# Altium project CAN_CANS6.PrjPcb
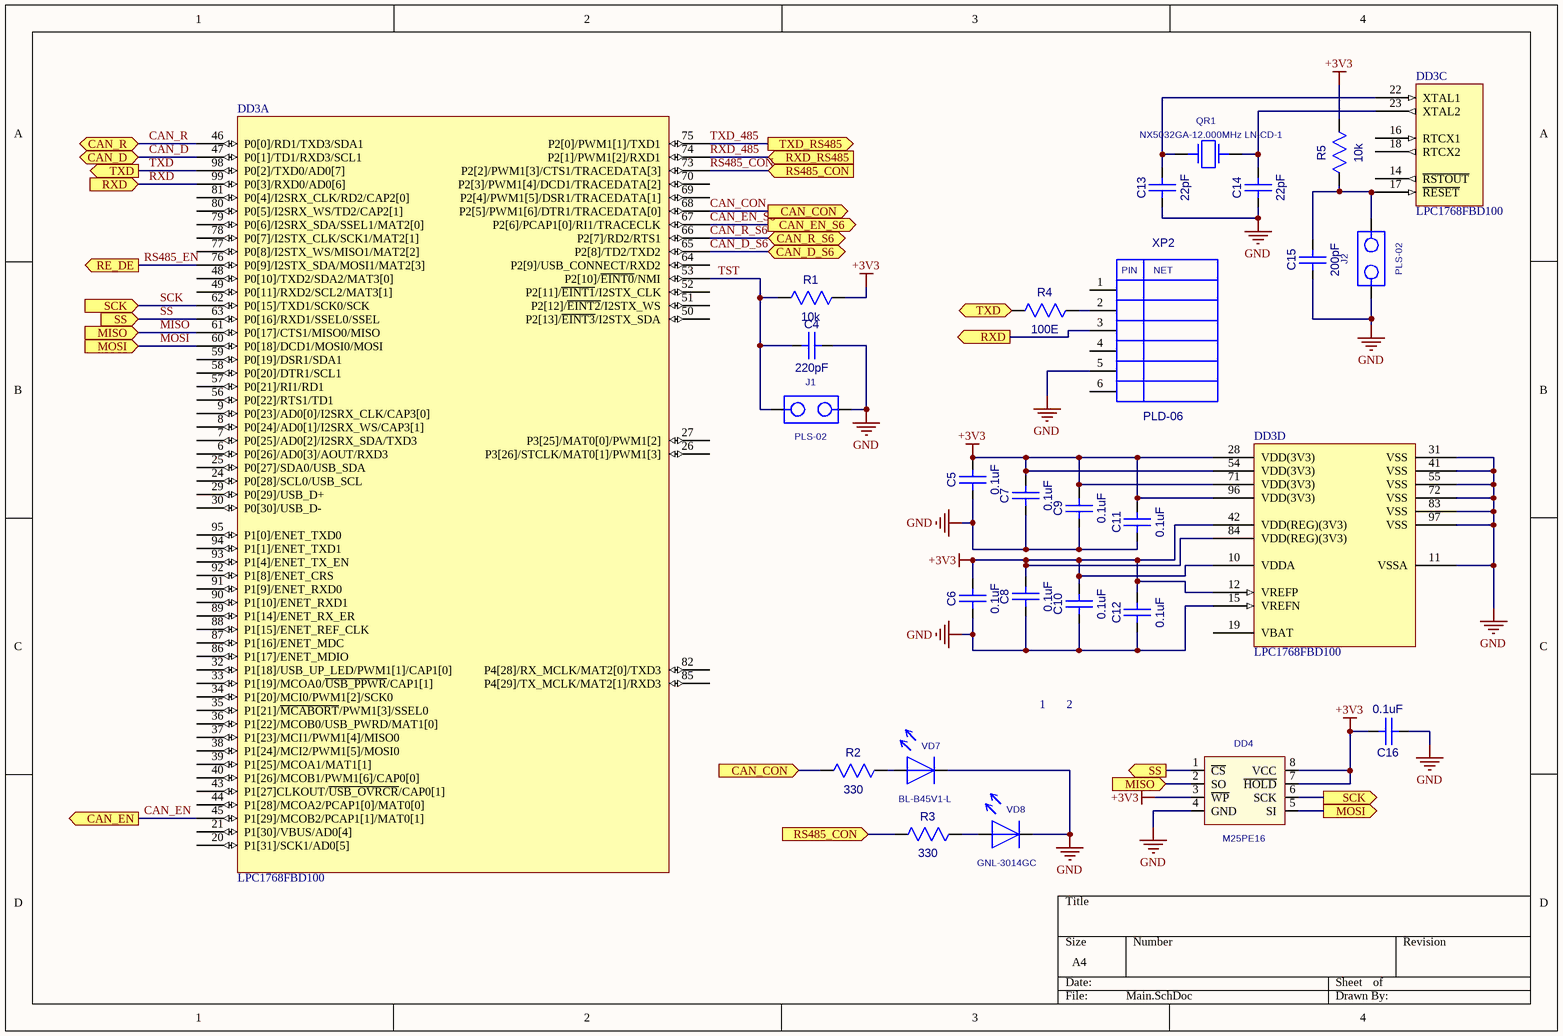
[diagram p0: Main.SchDoc]
3 sheets, 72 parts. Net scope: flat (ports and power ports of the same name join across sheets).
Board file: CAN_CANS6.PcbDoc
Sheets:
  Main.SchDoc
  Interface.SchDoc
  Power.SchDoc

## Sheet Main.SchDoc
size A4

### Parts
1  REPER1.2  [REPER1.2]  (value not drawn)
2  REPER1.2  [REPER1.2]  (value not drawn)
C4  220pF  [CC0603-3M]
C5  0.1uF  [CC0603-3M]
C6  0.1uF  [CC0603-3M]
C7  0.1uF  [CC0603-3M]
C8  0.1uF  [CC0603-3M]
C9  0.1uF  [CC0603-3M]
C10  0.1uF  [CC0603-3M]
C11  0.1uF  [CC0603-3M]
C12  0.1uF  [CC0603-3M]
C13  22pF  [CC0603-3M]
C14  22pF  [CC0603-3M]
C15  200pF  [CC0603-3M]
C16  0.1uF  [CC0603-3M]
DD3  LPC1768FBD100  [TQFP-100]  (parts A,C,D of 4)
DD4  M25PE16  [EIAJ_SO8]
J1  PLS-02  [PLS-02]
J2  PLS-02  [PIN2W]
QR1  NX5032GA-12.000MHz LN-CD-1  [AC5032_2]
R1  10k  [RC0603-3M]
R2  330  [RC0603-3M]
R3  330  [RC0603-3M]
R4  100E  [RC0603-3M]
R5  10k  [RC0603-3M]
VD7  BL-B45V1-L  [LED3]
VD8  GNL-3014GC  [LED3]
XP2  PLD-06  [PLD-06]

### Ports
CAN_CON (in), CAN_CON (out), CAN_D, CAN_D_S6, CAN_EN (out), CAN_EN_S6 (out), CAN_R, CAN_R_S6, MISO (in), MOSI (in), MOSI (out), RE_DE (out), RS485_CON (in), RXD (in), RXD (out), RXD_RS485 (in), SCK (in), SCK (out), SS (in), SS (out), TXD (in), TXD (out), TXD_RS485 (out)

### Nets
+3V3: C5.2(B) C6.2(B) C7.2(B) C8.2(B) C9.2(B) C10.2(B) C11.2(B) C12.2(B) C16.2(B) DD3.10(VDDA) DD3.12(VREFP) DD3.28(VDD(3V3)) DD3.42(VDD(REG)(3V3)) DD3.54(VDD(3V3)) DD3.71(VDD(3V3)) DD3.84(VDD(REG)(3V3)) DD3.96(VDD(3V3)) DD4.3(~{WP}) DD4.7(~{HOLD}) DD4.8(VCC) R1.2(B) R5.2(B)
GND: C4.2(B) C5.1(A) C6.1(A) C7.1(A) C8.1(A) C9.1(A) C10.1(A) C11.1(A) C12.1(A) C13.1(A) C14.1(A) C15.1(A) C16.1(A) DD3.11(VSSA) DD3.15(VREFN) DD3.31(VSS) DD3.41(VSS) DD3.55(VSS) DD3.72(VSS) DD3.83(VSS) DD3.97(VSS) DD4.4(GND) J1.2 J2.1 VD7.1 VD8.1 XP2.5
CAN_CON: DD3.68(P2[5]/PWM1[6]/DTR1/TRACEDATA[0]) R2.1(A) ; port CAN_CON
CAN_D: DD3.47(P0[1]/TD1/RXD3/SCL1) ; port CAN_D
CAN_D_S6: DD3.65(P2[8]/TD2/TXD2) ; port CAN_D_S6
CAN_EN: DD3.45(P1[29]/MCOB2/PCAP1[1]/MAT0[1]) ; port CAN_EN
CAN_EN_S6: DD3.67(P2[6]/PCAP1[0]/RI1/TRACECLK) ; port CAN_EN_S6
CAN_R: DD3.46(P0[0]/RD1/TXD3/SDA1) ; port CAN_R
CAN_R_S6: DD3.66(P2[7]/RD2/RTS1) ; port CAN_R_S6
MISO: DD3.61(P0[17]/CTS1/MISO0/MISO) DD4.2(SO) ; port MISO
MOSI: DD3.60(P0[18]/DCD1/MOSI0/MOSI) DD4.5(SI) ; port MOSI
RS485_CON: DD3.73(P2[2]/PWM1[3]/CTS1/TRACEDATA[3]) R3.1(A) ; port RS485_CON
RS485_EN: DD3.76(P0[9]/I2STX_SDA/MOSI1/MAT2[3]) ; port RE_DE
RXD: DD3.99(P0[3]/RXD0/AD0[6]) XP2.3 ; port RXD
RXD_485: DD3.74(P2[1]/PWM1[2]/RXD1) ; port RXD_RS485
SCK: DD3.62(P0[15]/TXD1/SCK0/SCK) DD4.6(SCK) ; port SCK
SS: DD3.63(P0[16]/RXD1/SSEL0/SSEL) DD4.1(~{CS}) ; port SS
TST: C4.1(A) DD3.53(P2[10]/~{EINT0}/NMI) J1.1 R1.1(A)
TXD: DD3.98(P0[2]/TXD0/AD0[7]) R4.1(A) ; port TXD
TXD_485: DD3.75(P2[0]/PWM1[1]/TXD1) ; port TXD_RS485
NetC13_2: C13.2(B) DD3.22(XTAL1) QR1.1
NetC14_2: C14.2(B) DD3.23(XTAL2) QR1.2
NetC15_2: C15.2(B) DD3.17(~{RESET}) J2.2 R5.1(A)
NetR2_2: R2.2(B) VD7.2
NetR3_2: R3.2(B) VD8.2
NetR4_2: R4.2(B) XP2.2

Not connected (* = marked no-connect by the designer): 1 1; 2 1; DD3 6(P0[26]/AD0[3]/AOUT/RXD3) 7(P0[25]/AD0[2]/I2SRX_SDA/TXD3) 8(P0[24]/AD0[1]/I2SRX_WS/CAP3[1]) 9(P0[23]/AD0[0]/I2SRX_CLK/CAP3[0]) 14(~{RSTOUT}) 16(RTCX1) 18(RTCX2) 19(VBAT) 20(P1[31]/SCK1/AD0[5]) 21(P1[30]/VBUS/AD0[4]) 24(P0[28]/SCL0/USB_SCL) 25(P0[27]/SDA0/USB_SDA) 26(P3[26]/STCLK/MAT0[1]/PWM1[3]) 27(P3[25]/MAT0[0]/PWM1[2]) 29(P0[29]/USB_D+) 30(P0[30]/USB_D-) 32(P1[18]/USB_UP_LED/PWM1[1]/CAP1[0]) 33(P1[19]/MCOA0/~{USB_PPWR}/CAP1[1]) 34(P1[20]/MCI0/PWM1[2]/SCK0) 35(P1[21]/~{MCABORT}/PWM1[3]/SSEL0) 36(P1[22]/MCOB0/USB_PWRD/MAT1[0]) 37(P1[23]/MCI1/PWM1[4]/MISO0) 38(P1[24]/MCI2/PWM1[5]/MOSI0) 39(P1[25]/MCOA1/MAT1[1]) 40(P1[26]/MCOB1/PWM1[6]/CAP0[0]) 43(P1[27]CLKOUT/~{USB_OVRCR}/CAP0[1]) 44(P1[28]/MCOA2/PCAP1[0]/MAT0[0]) 48(P0[10]/TXD2/SDA2/MAT3[0]) 49(P0[11]/RXD2/SCL2/MAT3[1]) 50(P2[13]/~{EINT3}/I2STX_SDA) 51(P2[12]/~{EINT2}/I2STX_WS) 52(P2[11]/~{EINT1}/I2STX_CLK) 56(P0[22]/RTS1/TD1) 57(P0[21]/RI1/RD1) 58(P0[20]/DTR1/SCL1) 59(P0[19]/DSR1/SDA1) 64(P2[9]/USB_CONNECT/RXD2) 69(P2[4]/PWM1[5]/DSR1/TRACEDATA[1]) 70(P2[3]/PWM1[4]/DCD1/TRACEDATA[2]) 77(P0[8]/I2STX_WS/MISO1/MAT2[2]) 78(P0[7]/I2STX_CLK/SCK1/MAT2[1]) 79(P0[6]/I2SRX_SDA/SSEL1/MAT2[0]) 80(P0[5]/I2SRX_WS/TD2/CAP2[1]) 81(P0[4]/I2SRX_CLK/RD2/CAP2[0]) 82(P4[28]/RX_MCLK/MAT2[0]/TXD3) 85(P4[29]/TX_MCLK/MAT2[1]/RXD3) 86(P1[17]/ENET_MDIO) 87(P1[16]/ENET_MDC) 88(P1[15]/ENET_REF_CLK) 89(P1[14]/ENET_RX_ER) 90(P1[10]/ENET_RXD1) 91(P1[9]/ENET_RXD0) 92(P1[8]/ENET_CRS) 93(P1[4]/ENET_TX_EN) 94(P1[1]/ENET_TXD1) 95(P1[0]/ENET_TXD0); XP2 1 4 6

### Notes on the sheet
- (in symbol PLD-06) PIN; NET

### Library data of the parts
C4-C16 = CC0603
  C4: Value: 220pF
  C5-C12 C16: Value: 0.1uF
  C13 C14: Value: 22pF
  C15: Value: 200pF
DD3 = LPC1768FBD100: Cortex -M3 32-Bit Microcontroller, 512KB Flash, 64KB RAM, 100-Lead LQFP; ComponentLink1Description: Manufacturer Link; ComponentLink1URL: http://www.nxp.com/
DD4 = S25FL016A0LMFI01: Value: M25PE16
QR1 = AC5032_2: AC5032/2; Value: NX5032GA-12.000MHz LN-CD-1
R1-R5 = RC0603
  R1 R5: Value: 10k
  R2 R3: Value: 330
  R4: Value: 100E
VD7 VD8 = LED_3
  VD7: Value: BL-B45V1-L
  VD8: Value: GNL-3014GC
XP2 = PLD-06: PLD06; Value: *
1 2 = REPER1.2: Value: *
J1 J2 = PLS-02: Value: *

## Sheet Interface.SchDoc
size A4
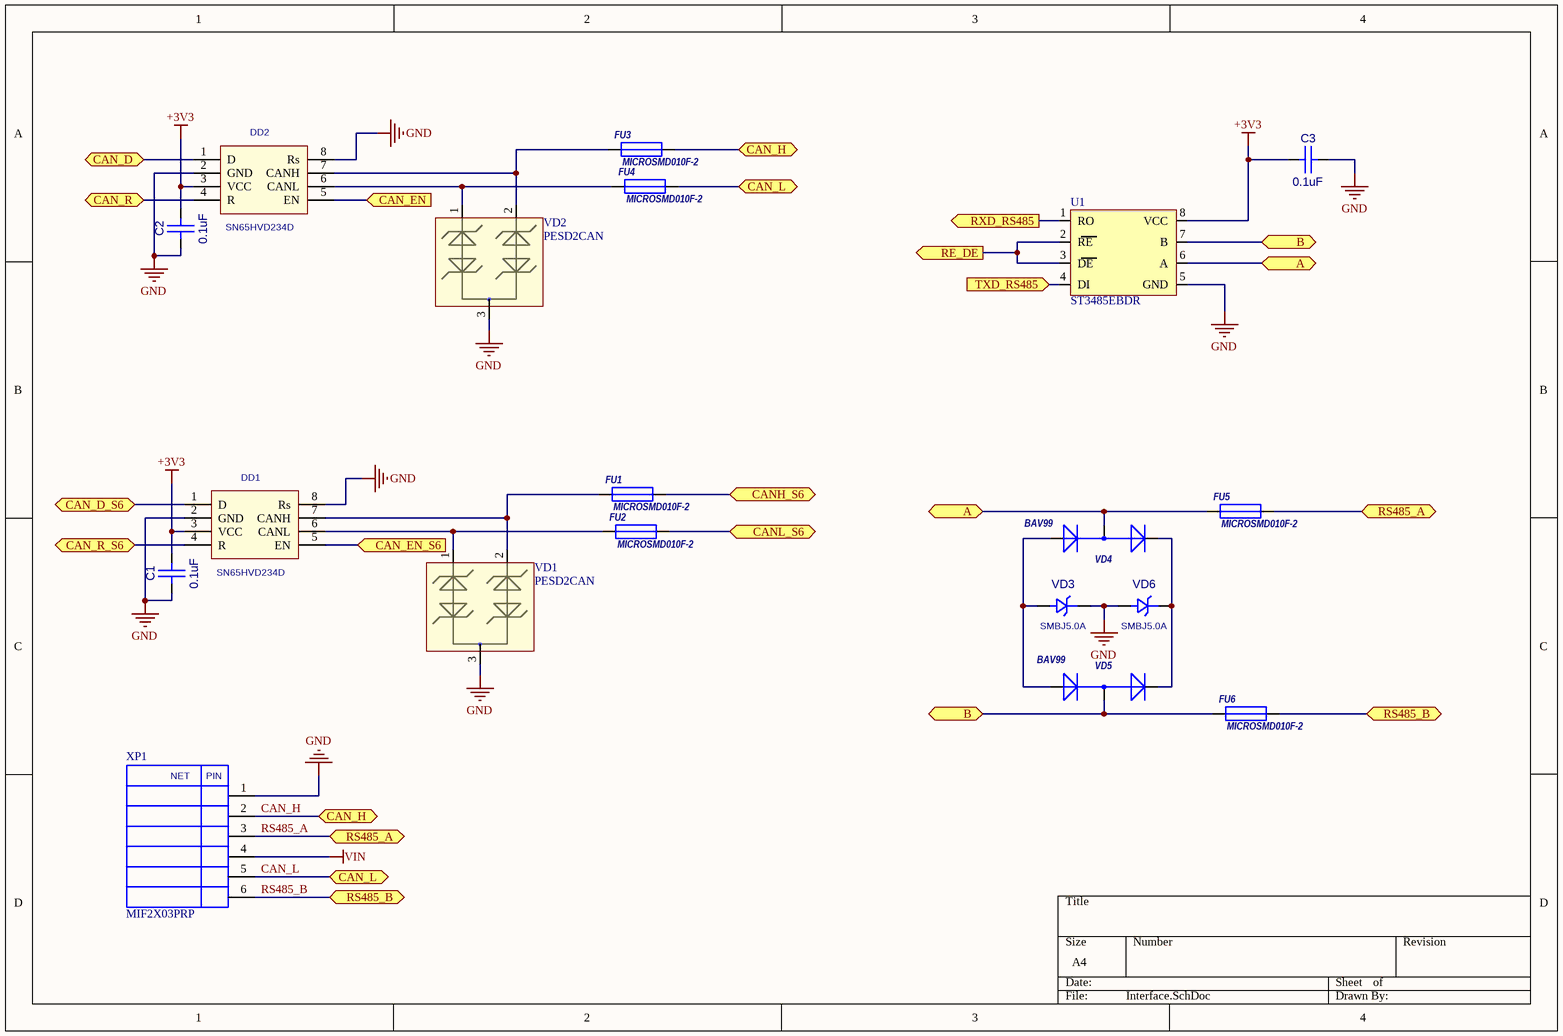
[diagram p1: Interface.SchDoc]

### Parts
C1  0.1uF  [CC0603-3M]
C2  0.1uF  [CC0603-3M]
C3  0.1uF  [CC0603-3M]
DD1  SN65HVD234D  [SO-8]
DD2  SN65HVD234D  [SO-8]
FU1  MICROSMD010F-2  [RC1210]
FU2  MICROSMD010F-2  [RC1210]
FU3  MICROSMD010F-2  [RC1210]
FU4  MICROSMD010F-2  [RC1210]
FU5  MICROSMD010F-2  [RC1210]
FU6  MICROSMD010F-2  [RC1210]
U1  ST3485EBDR  [SO-8]
VD1  PESD2CAN  [SOT-23(123)]
VD2  PESD2CAN  [SOT-23(123)]
VD3  SMBJ5.0A  [SMB]
VD4  BAV99  [SOT-23(GSD)]
VD5  BAV99  [SOT-23(GSD)]
VD6  SMBJ5.0A  [SMB]
XP1  MIF2X03PRP  [MIF2X03PRP]

### Ports
A (bidir), B (bidir), CAN_D, CAN_D_S6, CAN_EN (in), CAN_EN_S6 (in), CAN_H, CAN_L, CAN_R, CAN_R_S6, CANH_S6, CANL_S6, RE_DE (out), RS485_A, RS485_B, RXD_RS485 (out), TXD_RS485 (in)

### Nets
+3V3: C1.2(B) C2.2(B) C3.1(A) DD1.3(VCC) DD2.3(VCC) U1.8(VCC)
GND: C1.1(A) C2.1(A) C3.2(B) DD1.2(GND) DD1.8(Rs) DD2.2(GND) DD2.8(Rs) U1.5(GND) VD1.3 VD2.3 VD3.2(K) VD6.1(A) XP1.1
VIN: XP1.4
CAN_D: DD2.1(D) ; port CAN_D
CAN_D_S6: DD1.1(D) ; port CAN_D_S6
CAN_EN: DD2.5(EN) ; port CAN_EN
CAN_EN_S6: DD1.5(EN) ; port CAN_EN_S6
CAN_H: FU3.2 XP1.2 ; port CAN_H
CAN_L: FU4.2 XP1.5 ; port CAN_L
CAN_R: DD2.4(R) ; port CAN_R
CAN_R_S6: DD1.4(R) ; port CAN_R_S6
CANH_S6: FU1.2 ; port CANH_S6
CANL_S6: FU2.2 ; port CANL_S6
RS485_A: FU5.2 XP1.3 ; port RS485_A
RS485_B: FU6.2 XP1.6 ; port RS485_B
RS485_EN: U1.2(RE) U1.3(DE) ; port RE_DE
RXD_485: U1.1(RO) ; port RXD_RS485
TXD_485: U1.4(DI) ; port TXD_RS485
NetDD1_6: DD1.6(CANL) FU2.1 VD1.1
NetDD1_7: DD1.7(CANH) FU1.1 VD1.2
NetDD2_6: DD2.6(CANL) FU4.1 VD2.1
NetDD2_7: DD2.7(CANH) FU3.1 VD2.2
NetFU5_1: FU5.1 U1.6(A) VD4.3(AK) ; port A
NetFU6_1: FU6.1 U1.7(B) VD5.3(AK) ; port B
NetVD3_1: VD3.1(A) VD4.1(A) VD5.1(A)
NetVD4_2: VD4.2(K) VD5.2(K) VD6.2(K)

### Library data of the parts
C1-C3 = CC0603: Value: 0.1uF
DD1 DD2 = SN65HVD234D: CAN Transceiver; Value: *
FU1-FU6 = MICROSMD
  FU1-FU4: Value: MICROSMD010F-2
  FU5 FU6: Value: *
VD1 VD2 = PESD2CAN: TVS for CAN
VD3 VD6 = SMBJ: Value: SMBJ5.0A
VD4 VD5 = BAV99: 1.0 Ampere General Purpose Rectifier; ComponentField6: Published 8-Jun-2000, Modified 11-July-2000: SIM Model Added.; Value: *
U1 = ST3485EBDR: Value: ST3485EBDR
XP1 = MIF2X03PRP: Value: *

## Sheet Power.SchDoc
size A4
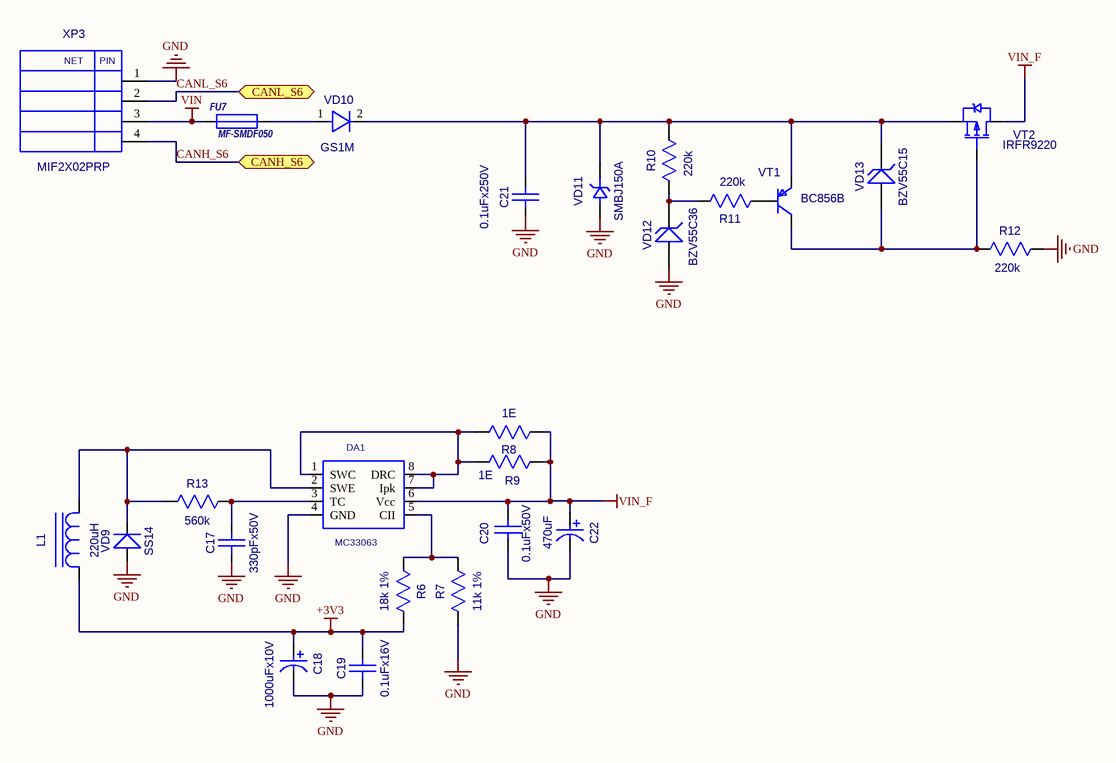
[diagram p2: Power.SchDoc]

### Parts
C17  330pFx50V  [CC0603-3M]
C18  1000uFx10V  [CC8X3.5]
C19  0.1uFx16V  [CC0603-3M]
C20  0.1uFx50V  [CC0603-3M]
C21  0.1uFx250V  [CC1206-MIDI]
C22  470uF  [CC16X10_CAP0.5(1)(Primary)]
DA1  MC33063  [SO-8]
FU7  MF-SMDF050  [MF-SMDF]
L1  220uH  [SDR0805]
R6  18k 1%  [RC0603-3M]
R7  11k 1%  [RC0603-3M]
R8  1E  [RC0805_IPC_NOM]
R9  1E  [RC0805_IPC_NOM]
R10  220k  [RC1206-2M]
R11  220k  [RC1206-2M]
R12  220k  [RC1206-2M]
R13  560k  [RC0603-3M]
VD9  SS14  [SMA]
VD10  GS1M  [SMA]
VD11  SMBJ150A  [SMB]
VD12  BZV55C36  [SOD-80]
VD13  BZV55C15  [SOD-80]
VT1  BC856B  [SOT-23(123)]
VT2  IRFR9220  [D-PAK(TO-252AA)]
XP3  MIF2X02PRP  [MIF2X02PRP]

### Ports
CANH_S6, CANL_S6

### Nets
+3V3: C18.1 C19.2(B) L1.1(C) R6.2(B)
GND: C17.1(A) C18.2 C19.1(A) C20.2(B) C21.1(A) C22.1 DA1.4(GND) R7.1(A) R12.2(B) VD9.1(A) VD11.1(A) VD12.1(A) XP3.1
VIN: FU7.1 XP3.3
VIN_F: C20.1(A) C22.2 DA1.6(Vcc) R8.1(A) R9.1(A) VT2.3(D)
CANH_S6: XP3.4 ; port CANH_S6
CANL_S6: XP3.2 ; port CANL_S6
NetC17_2: C17.2(B) DA1.3(TC) R13.2(B)
NetC21_2: C21.2(B) R10.2(B) VD10.2(K) VD11.2(K) VD13.2 VT1.2(E) VT2.2(S)
NetDA1_1: DA1.1(SWC) DA1.7(Ipk) DA1.8(DRC) R8.2(B) R9.2(B)
NetDA1_2: DA1.2(SWE) L1.2(A) R13.1(A) VD9.2(K)
NetDA1_5: DA1.5(CII) R6.1(A) R7.2(B)
NetFU7_2: FU7.2 VD10.1(A)
NetR10_1: R10.1(A) R11.2(B) VD12.2
NetR11_1: R11.1(A) VT1.1(B)
NetR12_1: R12.1(A) VD13.1(A) VT1.3(C) VT2.1(G)

### Notes on the sheet
- (in symbol MIF2X02PRP) NET; PIN

### Library data of the parts
C17 C19 C20 = CC0603
  C17: Value: 330pFx50V
  C19: Value: 0.1uFx16V
  C20: Value: 0.1uFx50V
C18 = CAP0.35: Value: 1000uFx10V
C21 = CC1206: Value: 0.1uFx250V
C22 = CAP0.5(1): Value: 470uF
DA1 = MC34063: Value: MC33063
FU7 = MF-SMDF: Value: MF-SMDF050
L1 = SDR0805: Value: 220uH
R6 R7 R13 = RC0603
  R6: Value: 18k 1%
  R7: Value: 11k 1%
  R13: Value: 560k
R8 R9 = RC0805: Value: 1E
R10-R12 = RC1206: Value: 220k
VD9 = SS14: Schottky Rectifier; Value: SS14
VD10 = GS1M: Value: {Value}
VD11 = SMBJ: Value: SMBJ150A
VD12 VD13 = BZV55C12: Zener Voltage Regulator Diode; OriginalName: BZX84C10LT1; ComponentField6: Pin 2 is not connected and not drawn.; ComponentField7: Published 29-Sep-2000
  VD12: Value: BZV55C36
  VD13: Value: BZV55C15
VT1 = BC856B: OriginalName: BC856BLT; ComponentField7: Published 29-Sep-2000; Value: BC856B
VT2 = IRFR9220: HEXFET Power MOSFET; OriginalName: IRLML5103; ComponentField7: Published 8-Jun-2000; Value: IRFR9220
XP3 = MIF2X02PRP: Value: *

## Nets that join several sheets
+3V3: Main (22 pins), Interface (6 pins), Power (C18.1 C19.2 L1.1 R6.2)
GND: Main (27 pins), Interface (13 pins), Power (13 pins)
VIN: Interface (XP1.4), Power (FU7.1 XP3.3)
CAN_D: Main (DD3.47), Interface (DD2.1)
CAN_D_S6: Main (DD3.65), Interface (DD1.1)
CAN_EN: Main (DD3.45), Interface (DD2.5)
CAN_EN_S6: Main (DD3.67), Interface (DD1.5)
CAN_R: Main (DD3.46), Interface (DD2.4)
CAN_R_S6: Main (DD3.66), Interface (DD1.4)
CANH_S6: Interface (FU1.2), Power (XP3.4)
CANL_S6: Interface (FU2.2), Power (XP3.2)
RS485_EN: Main (DD3.76), Interface (U1.2 U1.3)
RXD_485: Main (DD3.74), Interface (U1.1)
TXD_485: Main (DD3.75), Interface (U1.4)